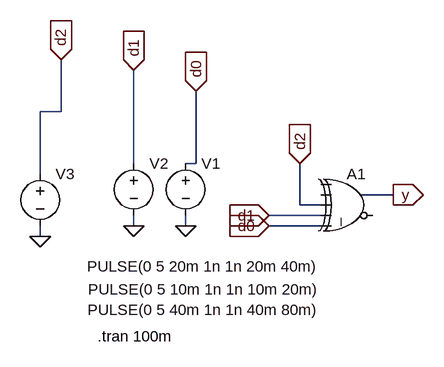
[diagram p0: schematic Draft1.asc]
Draft1.asc, the LTspice schematic file:
Version 4
SHEET 1 880 680
WIRE -272 -32 -272 -112
WIRE -272 -32 -304 -32
WIRE -160 48 -160 -96
WIRE -64 48 -64 -64
WIRE -64 48 -80 48
WIRE -304 64 -304 -32
WIRE 240 96 192 96
WIRE 96 112 96 48
WIRE 128 112 96 112
WIRE 128 128 48 128
WIRE -160 144 -160 128
WIRE -80 144 -80 128
WIRE 128 144 48 144
WIRE -304 160 -304 144
FLAG 48 144 d0
IOPIN 48 144 In
FLAG 48 128 d1
IOPIN 48 128 In
FLAG 240 96 y
IOPIN 240 96 Out
FLAG -80 144 0
FLAG -160 144 0
FLAG -64 -64 d0
IOPIN -64 -64 In
FLAG -160 -96 d1
IOPIN -160 -96 In
FLAG 96 48 d2
IOPIN 96 48 In
FLAG -272 -112 d2
IOPIN -272 -112 In
FLAG -304 160 0
SYMBOL Digital\\xor 176 48 R0
SYMATTR InstName A1
SYMBOL voltage -80 32 R0
WINDOW 3 -150 210 Left 2
WINDOW 123 0 0 Left 0
WINDOW 39 0 0 Left 0
SYMATTR InstName V1
SYMATTR Value PULSE(0 5 10m 1n 1n 10m 20m)
SYMBOL voltage -160 32 R0
WINDOW 3 -72 174 Left 2
WINDOW 123 0 0 Left 0
WINDOW 39 0 0 Left 0
SYMATTR InstName V2
SYMATTR Value PULSE(0 5 20m 1n 1n 20m 40m)
SYMBOL voltage -304 48 R0
WINDOW 3 73 225 Left 2
WINDOW 123 0 0 Left 0
WINDOW 39 0 0 Left 0
SYMATTR InstName V3
SYMATTR Value PULSE(0 5 40m 1n 1n 40m 80m)
TEXT -216 314 Left 2 !.tran 100m

The netlist it stands for:
* Draft1.asc
A1 0 0 d2 d1 d0 0 y 0 XOR
V1 d0 0 PULSE(0 5 10m 1n 1n 10m 20m)
V2 d1 0 PULSE(0 5 20m 1n 1n 20m 40m)
V3 d2 0 PULSE(0 5 40m 1n 1n 40m 80m)
.tran 100m
.backanno
.end

* Results of the author's LTspice run, read from the files saved beside the schematic
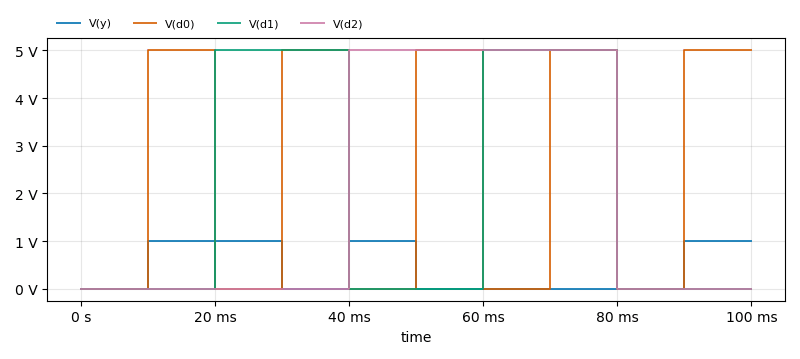
[diagram p1: Transient Analysis of Draft1.asc, plotted from the saved traces]
* Transient Analysis, 1 run:
*   V(y): min 0 V, max 1 V, average 400 mV, rms 632.5 mV, last 1 V
*   V(d0): min 0 V, max 5 V, average 2.5 V, rms 3.536 V, last 5 V
*   V(d1): min 0 V, max 5 V, average 2 V, rms 3.162 V, last 0 V
*   V(d2): min 0 V, max 5 V, average 2 V, rms 3.162 V, last 0 V